# Altium schematic sheet temp.SchDoc
size 297 x 210 mm
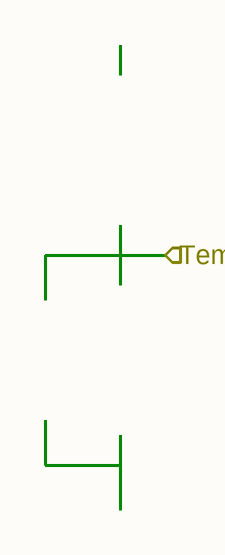
[diagram p0: temp.SchDoc]

## Ports
Temp (in)

## Notes on the sheet
- 1
- 2
- 3
- 4
- 5
- 6
- A
- B
- C
- D
- Title: BLDC Driver 4.11
- File: temp.sch
- Sheet: /
- Benjamin Vedder
- KiCad E.D.A.  kicad (5.1.4)-1
- Size: A4
- Date: 21 aug 2015
- Rev: 4.12
- Id: 3/7